# Altium schematic sheet cell-modem-gps.SchDoc
size Tabloid; CompanyName: Brinton Engineering, LLC; Address1: 3479 Edison Way; Address2: Menlo Park CA 94025; Address3: +1 (877) 778-8435; Address4: brintonengineering.com; Revision: 1; SheetNumber: 1; SheetTotal: 1
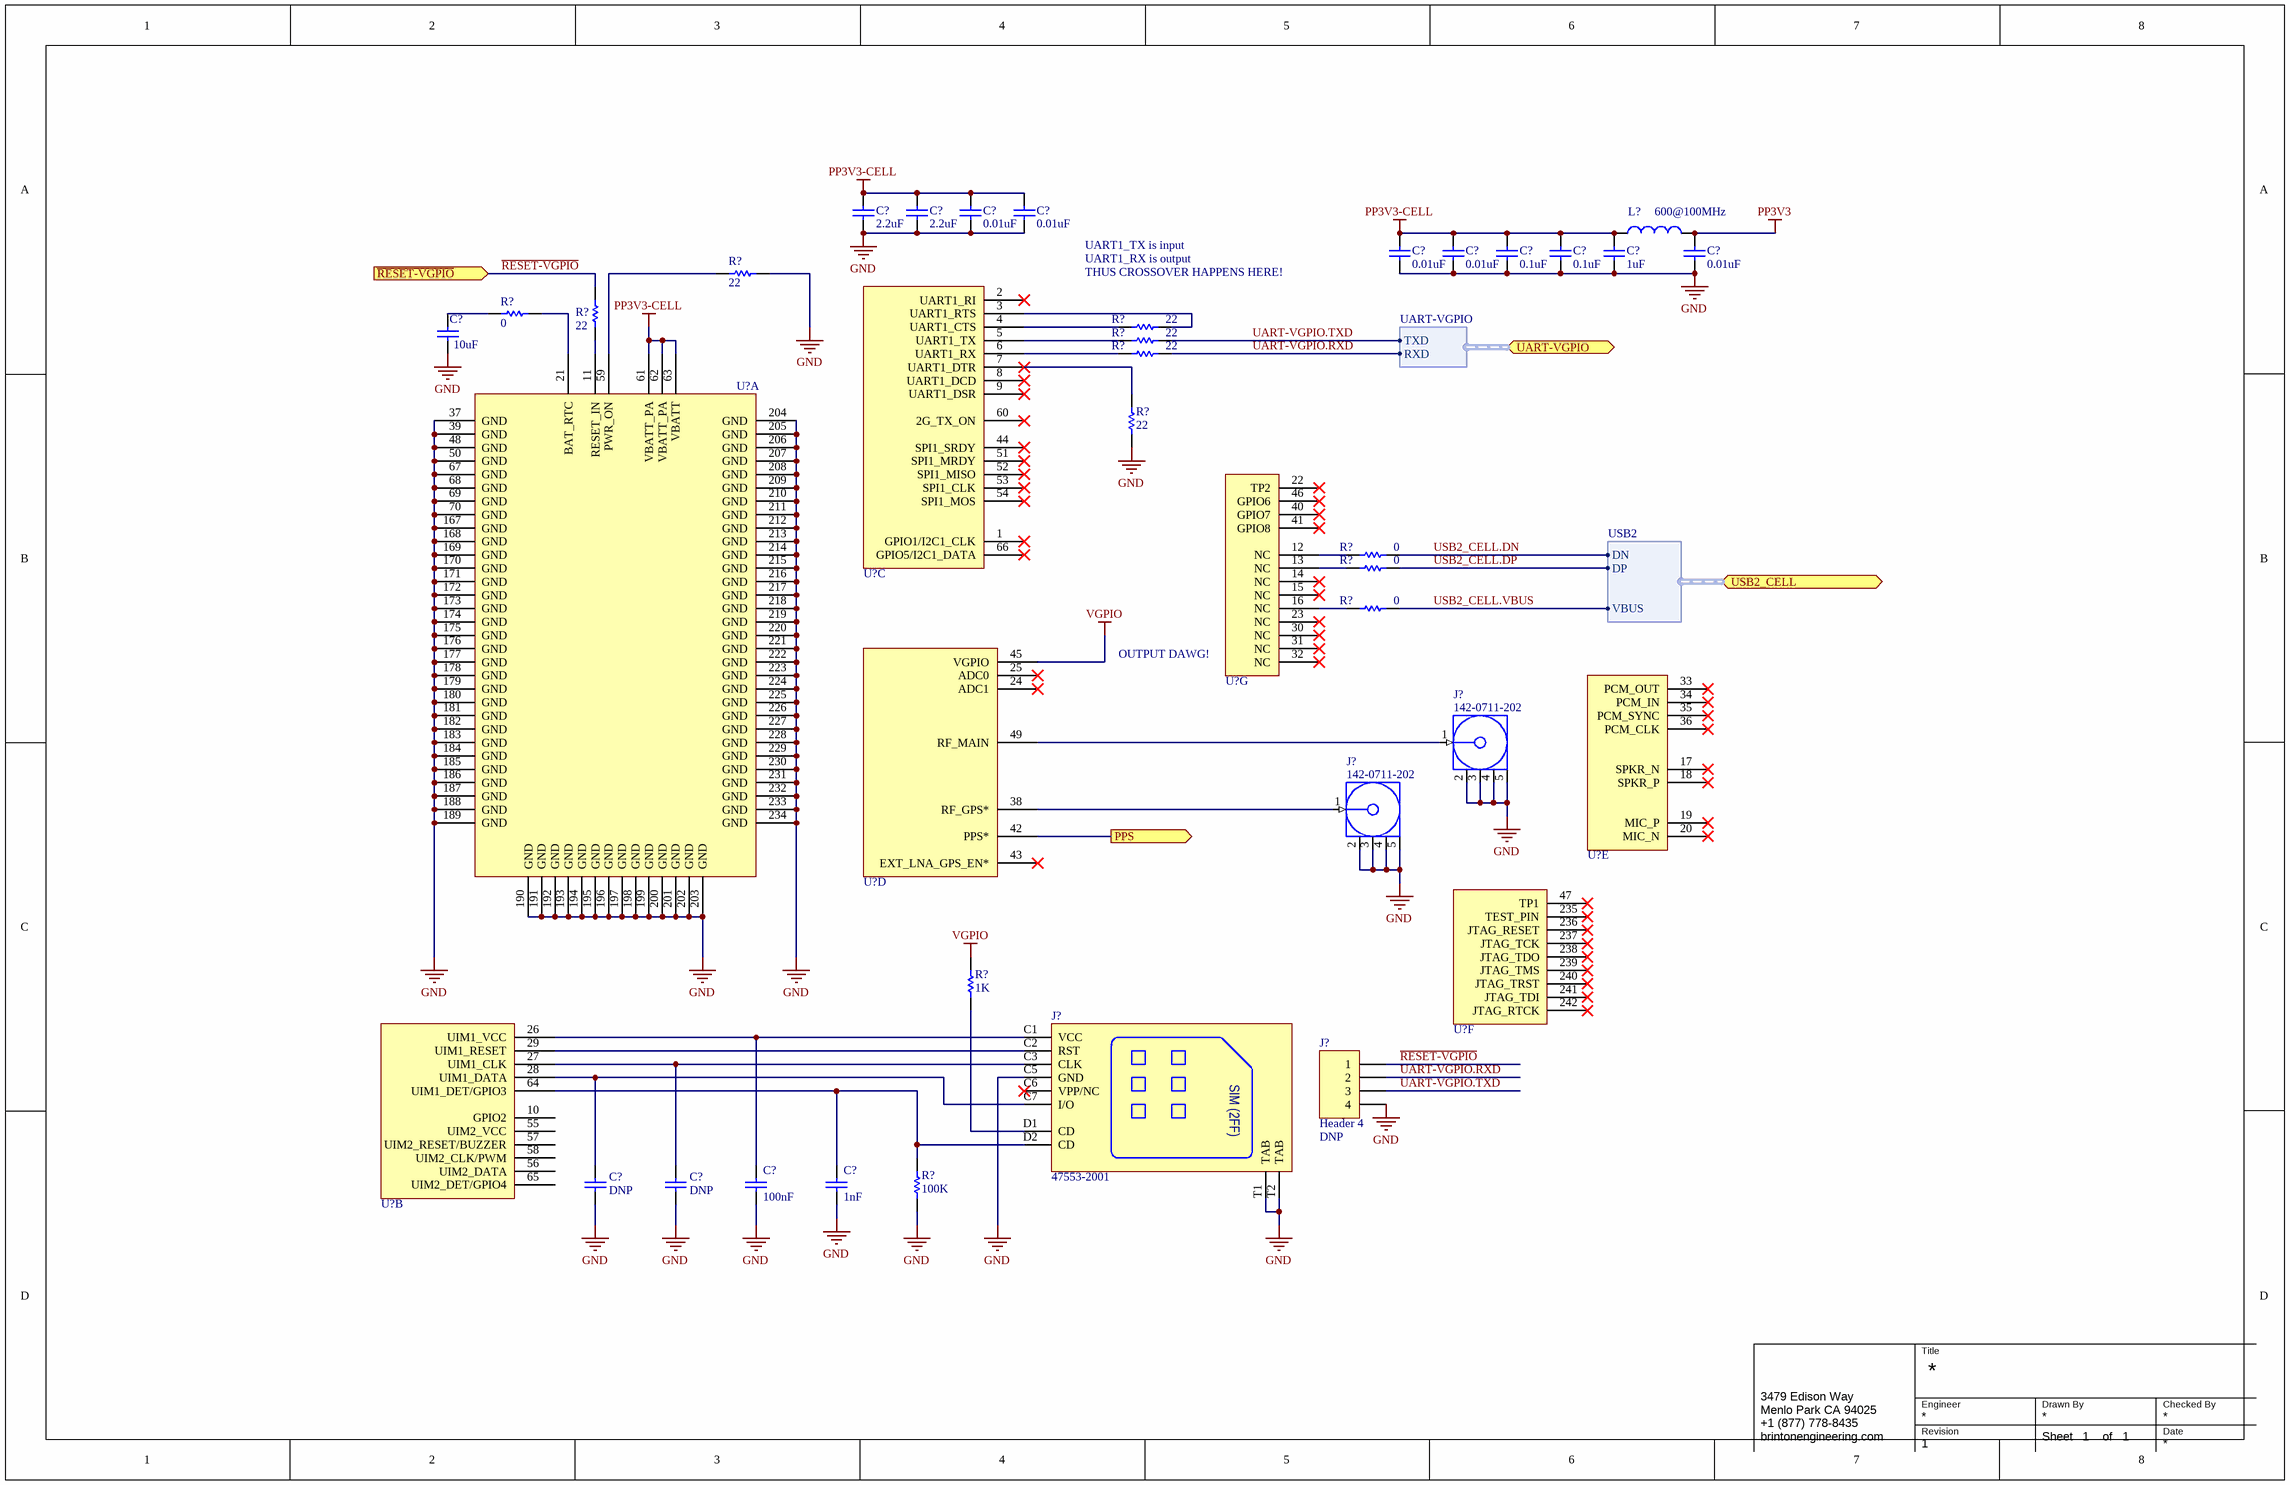
[diagram p0: cell-modem-gps.SchDoc]

## Parts
(Parts that share a designator on the sheet are numbered #1, #2 ... from top to bottom, then left to right.)
C?#1  value 2.2uF  [1206]  (hidden comment: CAP 0402)
C?#2  value 2.2uF  [1206]  (hidden comment: CAP 0402)
C?#3  value 0.01uF  [0402]  (hidden comment: CAP 0402)
C?#4  value 0.01uF  [0402]  (hidden comment: CAP 0402)
C?#5  value 0.01uF  [0402]  (hidden comment: CAP 0402)
C?#6  value 0.01uF  [0402]  (hidden comment: CAP 0402)
C?#7  value 0.1uF  [0402]  (hidden comment: CAP 0402)
C?#8  value 0.1uF  [0402]  (hidden comment: CAP 0402)
C?#9  value 1uF  [0402]  (hidden comment: CAP 0402)
C?#10  value 0.01uF  [0402]  (hidden comment: CAP 0402)
C?#11  value 10uF  [0805]  (hidden comment: CAP 10UF 0805)
C?#12  Do Not Place: DNP  [0603]  (hidden comment: CAP 100NF 0603)  (no BOM)
C?#13  Do Not Place: DNP  [0603]  (hidden comment: CAP 100NF 0603)  (no BOM)
C?#14  value 100nF  [0603]  (hidden comment: CAP 100NF 0603)
C?#15  value 1nF  [0603]  (hidden comment: CAP 1NF 0603)
J?#1  142-0711-202  [142-0711-202]
J?#2  142-0711-202  [142-0711-202]
J?#3  Header 4  Do Not Place: DNP  [HDR1X4]
J?#4  47553-2001  [47553-2001]
L?  value 600@100MHz  [0402]  (hidden comment: IND 0402)
R?#1  value 22  [0603]  (hidden comment: RES 22 0603)
R?#2  value 0  [0603]  (hidden comment: RES 0 0603)
R?#3  value 22  [0603]  (hidden comment: RES 22 0603)
R?#4  value 22  [0603]  (hidden comment: RES 22 0603)
R?#5  value 22  [0603]  (hidden comment: RES 22 0603)
R?#6  value 22  [0603]  (hidden comment: RES 22 0603)
R?#7  value 22  [0603]  (hidden comment: RES 22 0603)
R?#8  value 0  [0603]  (hidden comment: RES 0 0603)
R?#9  value 0  [0603]  (hidden comment: RES 0 0603)
R?#10  value 0  [0603]  (hidden comment: RES 0 0603)
R?#11  value 1K  [0603]  (hidden comment: RES 1K 0603)
R?#12  value 100K  [0603]  (hidden comment: RES 100K 0603)
U?#1  HL6528-G2.8V  [HL8548]  (value not drawn)  (part C of 7)
U?#2  HL6528-G2.8V  [HL8548]  (value not drawn)  (part G of 7)
U?#3  HL6528-G2.8V  [HL8548]  (value not drawn)  (part A of 7)
U?#4  HL6528-G2.8V  [HL8548]  (value not drawn)  (part D of 7)
U?#5  HL6528-G2.8V  [HL8548]  (value not drawn)  (part E of 7)
U?#6  HL6528-G2.8V  [HL8548]  (value not drawn)  (part F of 7)
U?#7  HL6528-G2.8V  [HL8548]  (value not drawn)  (part B of 7)

## Ports
PPS (out), UART-VGPIO (harness UART-VGPIO), USB2_CELL (harness USB2), ~{RESET-VGPIO} (in)

## Harnesses
UART-VGPIO: RXD, TXD
USB2: DN, DP, VBUS

## Nets
GND: C?#1.1 C?#2.1 C?#3.1 C?#4.1 C?#5.1 C?#6.1 C?#7.1 C?#8.1 C?#9.1 C?#10.1 C?#11.1 C?#12.1 C?#13.1 C?#14.1 C?#15.1 J?#1.2(GND) J?#1.3(GND) J?#1.4(GND) J?#1.5(GND) J?#2.2(GND) J?#2.3(GND) J?#2.4(GND) J?#2.5(GND) J?#3.4 J?#4.C5(GND) J?#4.T1(TAB) J?#4.T2(TAB) R?#1.2 R?#7.2 R?#12.2 U?#3.37(GND) U?#3.39(GND) U?#3.48(GND) U?#3.50(GND) U?#3.67(GND) U?#3.68(GND) U?#3.69(GND) U?#3.70(GND) U?#3.167(GND) U?#3.168(GND) U?#3.169(GND) U?#3.170(GND) U?#3.171(GND) U?#3.172(GND) U?#3.173(GND) U?#3.174(GND) U?#3.175(GND) U?#3.176(GND) U?#3.177(GND) U?#3.178(GND) U?#3.179(GND) U?#3.180(GND) U?#3.181(GND) U?#3.182(GND) U?#3.183(GND) U?#3.184(GND) U?#3.185(GND) U?#3.186(GND) U?#3.187(GND) U?#3.188(GND) U?#3.189(GND) U?#3.190(GND) U?#3.191(GND) U?#3.192(GND) U?#3.193(GND) U?#3.194(GND) U?#3.195(GND) U?#3.196(GND) U?#3.197(GND) U?#3.198(GND) U?#3.199(GND) U?#3.200(GND) U?#3.201(GND) U?#3.202(GND) U?#3.203(GND) U?#3.204(GND) U?#3.205(GND) U?#3.206(GND) U?#3.207(GND) U?#3.208(GND) U?#3.209(GND) U?#3.210(GND) U?#3.211(GND) U?#3.212(GND) U?#3.213(GND) U?#3.214(GND) U?#3.215(GND) U?#3.216(GND) U?#3.217(GND) U?#3.218(GND) U?#3.219(GND) U?#3.220(GND) U?#3.221(GND) U?#3.222(GND) U?#3.223(GND) U?#3.224(GND) U?#3.225(GND) U?#3.226(GND) U?#3.227(GND) U?#3.228(GND) U?#3.229(GND) U?#3.230(GND) U?#3.231(GND) U?#3.232(GND) U?#3.233(GND) U?#3.234(GND)
PP3V3: C?#10.2 L?.1
PP3V3-CELL: C?#1.2 C?#2.2 C?#3.2 C?#4.2 C?#5.2 C?#6.2 C?#7.2 C?#8.2 C?#9.2 L?.2 U?#3.61(VBATT_PA) U?#3.62(VBATT_PA) U?#3.63(VBATT)
VGPIO: R?#11.1 U?#4.45(VGPIO)
~{RESET-VGPIO}: J?#3.1 R?#3.1 ; port ~{RESET-VGPIO}
PPS: U?#4.42(PPS*) ; port PPS
UART-VGPIO.RXD: J?#3.2 R?#6.1 ; port UART-VGPIO.RXD
UART-VGPIO.TXD: J?#3.3 R?#5.1 ; port UART-VGPIO.TXD
USB2_CELL.DN: R?#8.2 ; port USB2_CELL.DN
USB2_CELL.DP: R?#9.2 ; port USB2_CELL.DP
USB2_CELL.VBUS: R?#10.2 ; port USB2_CELL.VBUS
NetC?#11_2: C?#11.2 R?#2.1
NetC?#12_2: C?#12.2 J?#4.C7(I/O) U?#7.28(UIM1_DATA)
NetC?#13_2: C?#13.2 J?#4.C3(CLK) U?#7.27(UIM1_CLK)
NetC?#14_2: C?#14.2 J?#4.C1(VCC) U?#7.26(UIM1_VCC)
NetC?#15_2: C?#15.2 J?#4.D2(CD) R?#12.1 U?#7.64(UIM1_DET/GPIO3)
NetJ?#1_1: J?#1.1(Signal) U?#4.49(RF_MAIN)
NetJ?#2_1: J?#2.1(Signal) U?#4.38(RF_GPS*)
NetJ?#4_C2: J?#4.C2(RST) U?#7.29(UIM1_RESET)
NetJ?#4_D1: J?#4.D1(CD) R?#11.2
NetR?#1_1: R?#1.1 U?#3.59(PWR_ON)
NetR?#2_2: R?#2.2 U?#3.21(BAT_RTC)
NetR?#3_2: R?#3.2 U?#3.11(RESET_IN)
NetR?#4_1: R?#4.1 U?#1.3(UART1_RTS)
NetR?#4_2: R?#4.2 U?#1.4(UART1_CTS)
NetR?#5_2: R?#5.2 U?#1.5(UART1_TX)
NetR?#6_2: R?#6.2 U?#1.6(UART1_RX)
NetR?#7_1: R?#7.1 U?#1.7(UART1_DTR)
NetR?#8_1: R?#8.1 U?#2.12(NC)
NetR?#9_1: R?#9.1 U?#2.13(NC)
NetR?#10_1: R?#10.1 U?#2.16(NC)

Not connected (* = marked no-connect by the designer): J?#4 C6(VPP/NC)*; U?#1 1(GPIO1/I2C1_CLK)* 2(UART1_RI)* 8(UART1_DCD)* 9(UART1_DSR)* 44(SPI1_SRDY)* 51(SPI1_MRDY)* 52(SPI1_MISO)* 53(SPI1_CLK)* 54(SPI1_MOS)* 60(2G_TX_ON)* 66(GPIO5/I2C1_DATA)*; U?#2 14(NC)* 15(NC)* 22(TP2)* 23(NC)* 30(NC)* 31(NC)* 32(NC)* 40(GPIO7)* 41(GPIO8)* 46(GPIO6)*; U?#4 24(ADC1)* 25(ADC0)* 43(EXT_LNA_GPS_EN*)*; U?#5 17(SPKR_N)* 18(SPKR_P)* 19(MIC_P)* 20(MIC_N)* 33(PCM_OUT)* 34(PCM_IN)* 35(PCM_SYNC)* 36(PCM_CLK)*; U?#6 47(TP1)* 235(TEST_PIN)* 236(JTAG_RESET)* 237(JTAG_TCK)* 238(JTAG_TDO)* 239(JTAG_TMS)* 240(JTAG_TRST)* 241(JTAG_TDI)* 242(JTAG_RTCK)*; U?#7 10(GPIO2) 55(UIM2_VCC) 56(UIM2_DATA) 57(UIM2_RESET/BUZZER) 58(UIM2_CLK/PWM) 65(UIM2_DET/GPIO4)

## Notes on the sheet
- UART1_TX is input
- UART1_RX is output
- (near R?#4) THUS CROSSOVER HAPPENS HERE!
- OUTPUT DAWG!
- Title
- Engineer
- Revision
- Drawn By
- Sheet
- of
- Checked By
- Date
- (in symbol 47553-2001) SIM (2FF)

## Library data of the parts
C?#1 C?#2 = CAP 0402: Manufacturer: Kemet; Manufacturer P/N: T491A225K010AT; Voltage: 16V; PCB Package: 1206
C?#3-C?#6 C?#10 = CAP 0402: Manufacturer: Murata; Manufacturer P/N: GRM155R71E103KA01D; Voltage: 25V; PCB Package: 0402
C?#7 C?#8 = CAP 0402: Manufacturer: Murata; Manufacturer P/N: GRM155R61A104KA01D; Voltage: 16V; PCB Package: 0402
C?#9 = CAP 0402: Manufacturer: TDK; Manufacturer P/N: C1005X7S1A105K050BC; Voltage: 10V; PCB Package: 0402
C?#11 = CAP: Ceramic Capacitor 10uF +/-20% 16V X5R 0805; Manufacturer: Taiyo Yuden; Manufacturer P/N: EMK212BJ106KG-T; Tolerance: *; Voltage: 16V; Footprint: *; Tr: *; Distributor: Digi-Key; Distributor P/N: *
C?#12-C?#14 = CAP: Ceramic Capacitor 100nF +/-10% 16V X7R 0603; Manufacturer: Kemet; Manufacturer P/N: C0603C104K4RACTU; Tolerance: *; Voltage: 16V; Footprint: *; Tr: *; Distributor: Digi-Key; Distributor P/N: *
  C?#12 C?#13: Value: 100nF
C?#15 = CAP: Ceramic Capacitor 1nF +/-10% 50V X7R 0603; Manufacturer: Kemet; Manufacturer P/N: C0603C102K5RACTU; Tolerance: *; Voltage: 50V; Footprint: *; Tr: *; Distributor: Digi-Key; Distributor P/N: *
J?#1 J?#2 = COAX-F: SMA Connector Jack; Standard Sex; SMD; Manufacturer: Emerson Connectivity; Manufacturer P/N: 142-0711-202
J?#3 = Header 4: Header, 4-Pin
J?#4 = 47553-2001: 1.27mm pitch SIM Card Holder; Manufacturer: Molex; Manufacturer P/N: 47553-2001
L? = IND 0402: Inductor; Manufacturer: Murata; Manufacturer P/N: BLM15PX601SN1D; PCB Package: 0402
R?#1 R?#3-R?#7 = RES: Thick Film Resistor 22 +/-1% 0603; Manufacturer: Panasonic; Manufacturer P/N: ERJ-3EKF22R0V; Tcr: *; Tolerance: *; Tr: *; Alternatives: *; Voltage: *; Power: *; Footprint: *; Distributor: Digi-Key; Distributor P/N: *
R?#2 R?#8-R?#10 = RES: Thick Film Resistor 0 +/-1% 0603; Manufacturer: Panasonic; Manufacturer P/N: ERJ-3GEY0R00V; Tcr: *; Tolerance: *; Tr: *; Alternatives: *; Voltage: *; Power: *; Footprint: *; Distributor: Digi-Key; Distributor P/N: *
R?#11 = RES: Thick Film Resistor 1k +/-1% 0603; Manufacturer: Panasonic; Manufacturer P/N: ERJ-3EKF1001V; Tcr: *; Tolerance: *; Tr: *; Alternatives: *; Voltage: *; Power: *; Footprint: *; Distributor: Digi-Key; Distributor P/N: *
R?#12 = RES: Thick Film Resistor 100k +/-1% 0603; Manufacturer: Panasonic; Manufacturer P/N: ERJ-3EKF1003V; Tcr: *; Tolerance: *; Tr: *; Alternatives: *; Voltage: *; Power: *; Footprint: *; Distributor: Digi-Key; Distributor P/N: *
U?#1-U?#7 = HL6528x: Industrial Grade quad-band GSM/GPRS Embedded Wireless Module; Manufacturer: Sierra Wireless; Footprint: *; Value: HL6528-G2.8V; Manufacturer P/N: HL6528-G2.8V; MfrNum: *; PartName: *; Vendor: *